# Altium schematic sheet Tay_Cam.SchDoc (part 2 of 3)
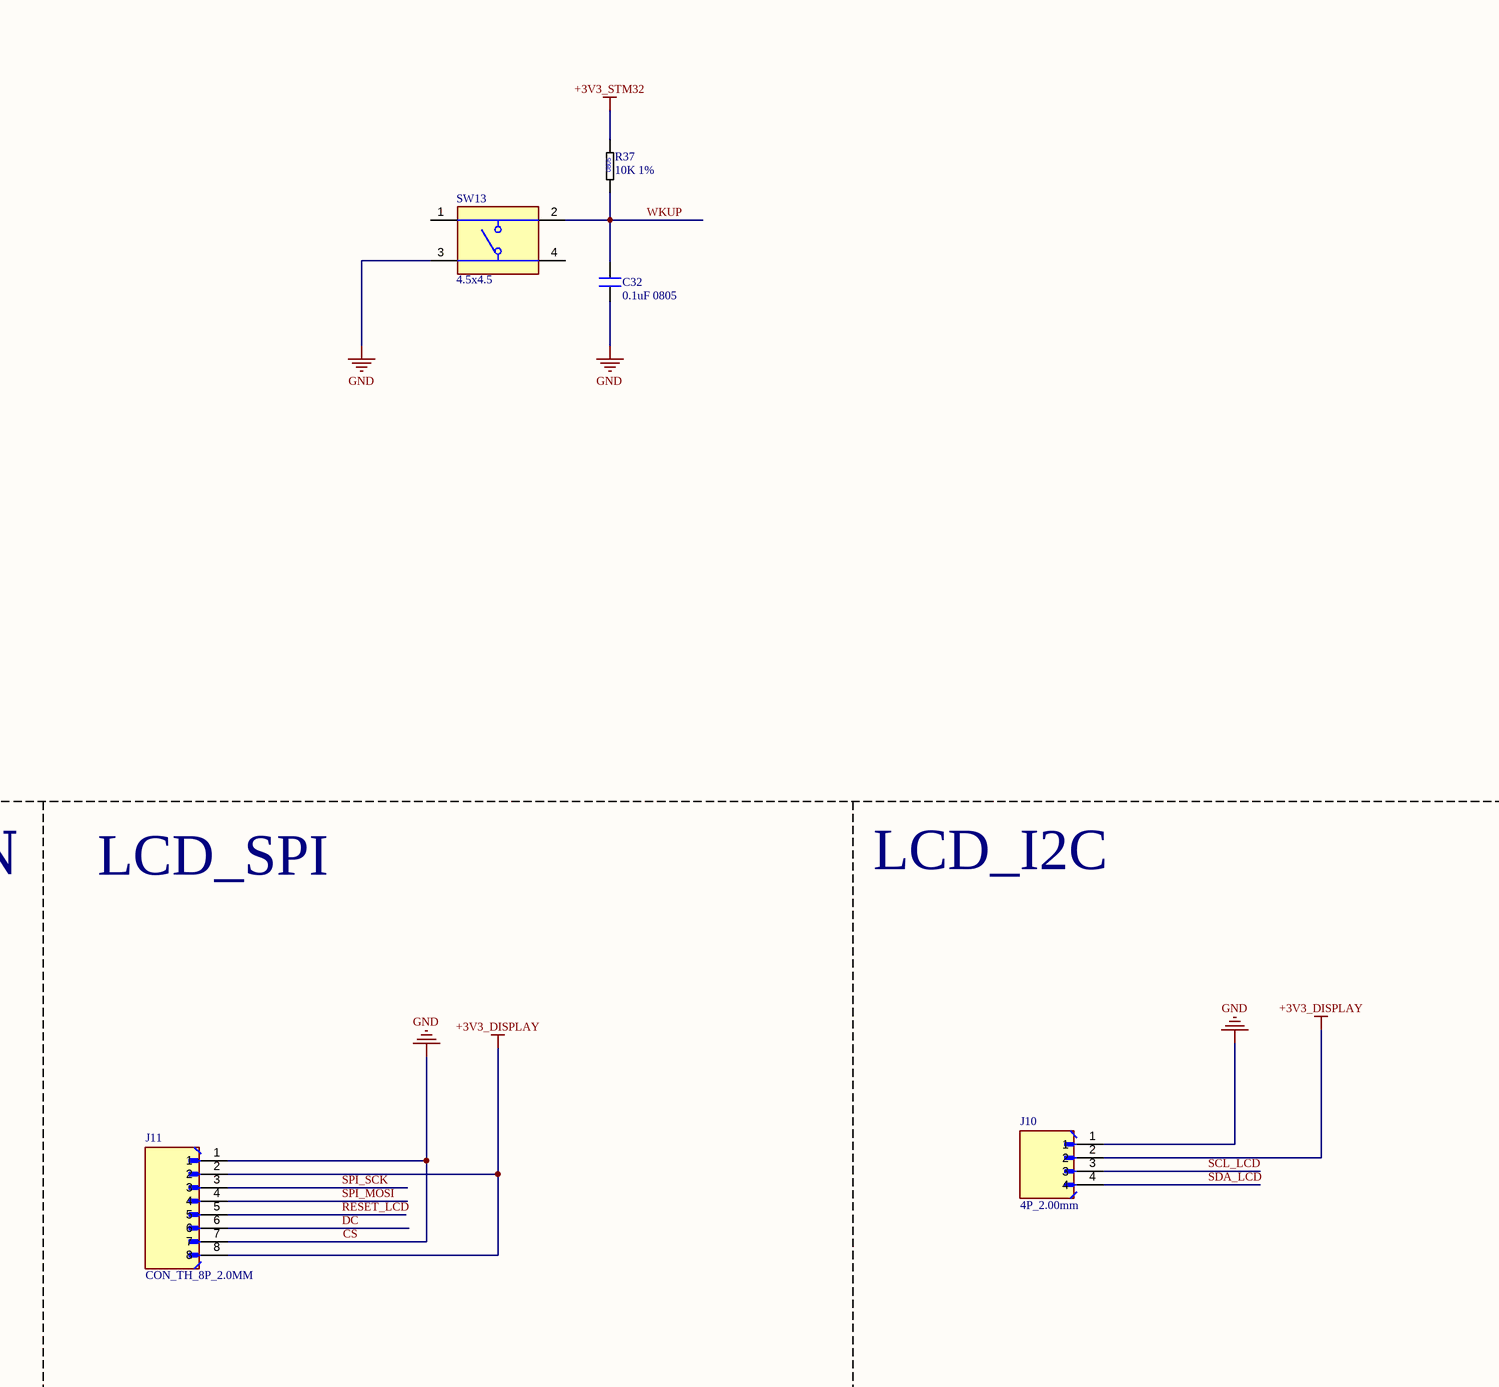
[diagram p8: Tay_Cam.SchDoc, bottom column 4 of 4]
## Library data of the parts
1 = CONN_SIM HOLDER 9P: 8 (6 + 2) Position Card Connector SIM Card Surface Mount, Right Angle Gold; Manufacturer: Molex; Manufacturer Part Number: 0475532001; LIBRARY MADE BY: MR. XUAN SIEU; Supplier 1: Digikey; RoHS: No; Category: Connectors; Stock 1: 21245; Pricing 1: 1=1.23, 10=1.043, 25=0.9776, 50=0.931, 100=0.8865, 250=0.83092, 500=0.79124 (USD); ComponentLink1URL: https://datasheet.octopart.com/SIM8066-6-1-14-01-A-Global-Connector-Technology-datasheet-155811920.pdf?src-supplier=Future+Electronics; ComponentLink1Description: https://datasheet.octopart.com/SIM8066-6-1-14-01-A-Global-Connector-Technology-datasheet-155811920.pdf?src-supplier=Future+Electronics; LINK VIET NAM: https://linhkien.cxtvn.com/2380-sim-card-holders-47553-2001.html; LINK ORIGINAL: https://www.digikey.com/en/products/detail/molex/0475532001/3262276?s=N4IgTCBcDaICwHYCsSDMBaMAGLBGEAugL5A; Link: https://muahang.nhaphangchina.vn/order/product/1688/45557949549
AT1 = Antenna_IPEX: Antenna
BUT1 = Nut Nhan 2 Chan SMD 3x6x2.5: Ma_Hang: MH001036; Ten: Nút Nhấn 2 Chân 3x6x2.5MM SMD
C1 C4 C9 C27 = CAP_CER_SMD; 1000PF 50V X7R 0805 10%: 1000 pF (102,1nF) ±10% 50V Ceramic Capacitor X7R 0805 (2012 Metric),; Manufacturer Cross: KEMET; Manufacturer Part Number: C0805C102K5RACTU; Dielectric Material: 4241ConductorMaterial; Temperature Coefficient: 30ppm/°C; LIBRARY MADE BY: MR. XUAN SIEU; Supplier 1: Digikey; RoHS: Yes; Category: Ceramic Capacitors; Stock 1: 269175; Pricing 1: 1=0.11, 10=0.061, 50=0.042, 100=0.0362, 500=0.02634, 1000=0.02329, 4000=0.01874, 8000=0.01701, 12000=0.01614, 20000=0.01517, 28000=0.0146, 40000=0.01406, 100000=0.01287, 200000=0.01215, 400000=0.01155 (USD); Mount: Surface Mount,PCB; Case/Package: 0805; Number of Pins: 2; Case Code (Imperial): 0805; Case Code (Metric): 2012; Material: 4241ConductorMaterial; Min Operating Temperature: -55°C; Max Operating Temperature: 125°C; Tolerance: 10%; Packaging: Tape and Reel; Capacitance: 1nF; Dielectric: X7R; Voltage: 50V; Series: SMD Comm X7R; Voltage Rating: 50V; Package Quantity: 4000; Termination: SMD/SMT; Construction: Flat; Voltage Rating (DC): 50V; Length: 2mm; Width: 1.25mm; Height: 0.78mm; Depth: 1.25mm; Lead Pitch: 0.75mm; Thickness: 889um; Radiation Hardening: No; Reach SVHC Compliant: No; RoHS Compliant: Yes; Lead Free: 5697LeadFree; ComponentLink1URL: https://www.distrelec.biz/Web/Downloads/_t/ds/KEM_C1002_X7R_SMD_eng_tds.pdf?mime=application%2Fpdf&src-supplier=Distrelec; ComponentLink1Description: https://www.distrelec.biz/Web/Downloads/_t/ds/KEM_C1002_X7R_SMD_eng_tds.pdf?mime=application%2Fpdf&src-supplier=Distrelec; ComponentLink2URL: http://www.farnell.com/datasheets/2740679.pdf?src-supplier=Farnell; ComponentLink2Description: http://www.farnell.com/datasheets/2740679.pdf?src-supplier=Farnell; ComponentLink3URL: http://www.onlinecomponents.com/productFiles/mf-KEM/kem_c1002_x7r_smd.pdf?src-supplier=Onlinecomponents.com; ComponentLink3Description: http://www.onlinecomponents.com/productFiles/mf-KEM/kem_c1002_x7r_smd.pdf?src-supplier=Onlinecomponents.com; ComponentLink4URL: http://www.farnell.com/datasheets/2740679.pdf?src-supplier=Element14; ComponentLink4Description: http://www.farnell.com/datasheets/2740679.pdf?src-supplier=Element14; ComponentLink5URL: https://datasheet.octopart.com/C0805C102K5RACTU-Kemet-datasheet-24570007.pdf?src-supplier=Element14; ComponentLink5Description: https://datasheet.octopart.com/C0805C102K5RACTU-Kemet-datasheet-24570007.pdf?src-supplier=Element14; ComponentLink6URL: https://api.kemet.com/component-edge/download/datasheet/C0805C102K5RACTU.pdf?src-supplier=Digikey; ComponentLink6Description: https://api.kemet.com/component-edge/download/datasheet/C0805C102K5RACTU.pdf?src-supplier=Digikey; ComponentLink7URL: http://www.farnell.com/datasheets/2740679.pdf?src-supplier=Newark; ComponentLink7Description: http://www.farnell.com/datasheets/2740679.pdf?src-supplier=Newark; ComponentLink8URL: https://www.alliedelec.com/m/d/9bfe7773041ffe9d406e68bc7b377fdd.pdf?src-supplier=Allied+Electronics; ComponentLink8Description: https://www.alliedelec.com/m/d/9bfe7773041ffe9d406e68bc7b377fdd.pdf?src-supplier=Allied+Electronics; Supplier Part Number 1: 399-C0805C102K5RACTUCT-ND; ComponentLink9Description: Link Viet Nam; ComponentLink9URL: https://linhkien.cxtvn.com/3023-tu-khong-phan-cuc-0805.html; ComponentLink10Description: Link Cross; ComponentLink10URL: https://www.lcsc.com/product-detail/Multilayer-Ceramic-Capacitors-MLCC-SMD-SMT_KEMET-C0805C102K5RACTU_C2167366.html?s_z=n_C0805C102K5RACTU; ComponentLink11Description: Link Original; ComponentLink11URL: https://www.digikey.com/en/products/detail/kemet/C0805C102K5RACTU/411146
C2 = CAP_CER_SMD; 10PF 50V C0G/NP0 0805 2.5%: Cap Ceramic 10pF 50V C0G 0.25pF Pad SMD 0805 125°C T/R; Manufacturer: Samsung Electro-Mechanics; Manufacturer Part Number: CL21C100CBANNNC; Temperature Coefficient: 30ppm/°C; Tolerance: 5%; LIBRARY MADE BY: MR. XUAN SIEU; Supplier 1: DigiKey; RoHS: Compliant; Category: Ceramic Capacitors; Stock 1: 78846; Pricing 1: 1=0.1, 10=0.044, 50=0.0302, 100=0.026, 500=0.0169, 1000=0.01376 (USD); Capacitance: 10pF; Case/Package: 0805; Case Code (Imperial): 0805; Case Code (Metric): 2012; China RoHS: Compliant; Depth: 1.25mm; Dielectric: C0G; Dielectric Material: Ceramic; Height: 650µm; Length: 2mm; Lifecycle Status: Production; Material: Ceramic; Max Operating Temperature: 125°C; Min Operating Temperature: -55°C; Mount: Surface Mount; Number of Terminals: 2; Radiation Hardening: No; REACH SVHC: Yes; Schedule B: 8532240020, 8532240020|8532240020, 8532240020|8532240020|8532240020, 8532240020|8532240020|8532240020|8532240020; Thickness: 762µm; Voltage: 50V; Voltage Rating: 50V; Voltage Rating (DC): 50V; Width: 1.25mm; ComponentLink1URL: https://datasheet.octopart.com:443/CL21C100CBANNNC-Samsung-Electro-Mechanics-datasheet-136551476.pdf?src-supplier=IHS; ComponentLink1Description: https://datasheet.octopart.com:443/CL21C100CBANNNC-Samsung-Electro-Mechanics-datasheet-136551476.pdf?src-supplier=IHS; ComponentLink2URL: https://datasheet.octopart.com:443/CL21C100CBANNNC-Samsung-Electro-Mechanics-datasheet-149066775.pdf?src-supplier=Future+Electronics; ComponentLink2Description: https://datasheet.octopart.com:443/CL21C100CBANNNC-Samsung-Electro-Mechanics-datasheet-149066775.pdf?src-supplier=Future+Electronics; ComponentLink3URL: https://datasheet.octopart.com:443/CL21C100CBANNNC-Samsung-Electro-Mechanics-datasheet-110334009.pdf?src-supplier=Future+Electronics; ComponentLink3Description: https://datasheet.octopart.com:443/CL21C100CBANNNC-Samsung-Electro-Mechanics-datasheet-110334009.pdf?src-supplier=Future+Electronics; ComponentLink4URL: https://datasheet.octopart.com:443/CL21C100CBANNNC-Samsung-Electro-Mechanics-datasheet-101746655.pdf?src-supplier=Future+Electronics; ComponentLink4Description: https://datasheet.octopart.com:443/CL21C100CBANNNC-Samsung-Electro-Mechanics-datasheet-101746655.pdf?src-supplier=Future+Electronics; ComponentLink5URL: https://datasheet.octopart.com/CL21C100CBANNNC-Samsung-Electro-Mechanics-datasheet-97040617.pdf; ComponentLink5Description: https://datasheet.octopart.com/CL21C100CBANNNC-Samsung-Electro-Mechanics-datasheet-97040617.pdf; ComponentLink6URL: https://datasheet.octopart.com/CL21C100CBANNNC-Samsung-Electro-Mechanics-datasheet-8324245.pdf; ComponentLink6Description: https://datasheet.octopart.com/CL21C100CBANNNC-Samsung-Electro-Mechanics-datasheet-8324245.pdf; ComponentLink7URL: https://datasheet.octopart.com/General-Multilayer-Ceramic-Capacitors-Samsung-datasheet-family-111.pdf; ComponentLink7Description: https://datasheet.octopart.com/General-Multilayer-Ceramic-Capacitors-Samsung-datasheet-family-111.pdf; ComponentLink8URL: https://datasheet.octopart.com:443/CL21C100CBANNNC-Samsung-datasheet-8326407.pdf?src-supplier=TME; ComponentLink8Description: https://datasheet.octopart.com:443/CL21C100CBANNNC-Samsung-datasheet-8326407.pdf?src-supplier=TME; ComponentLink9URL: http://sigma.octopart.com:80/rohs_certificate/General-Multilayer-Ceramic-Capacitors-Samsung-family-110.pdf?src-supplier=Compliance+Statements; ComponentLink9Description: http://sigma.octopart.com:80/rohs_certificate/General-Multilayer-Ceramic-Capacitors-Samsung-family-110.pdf?src-supplier=Compliance+Statements; ComponentLink10URL: http://sigma.octopart.com:80/rohs_statement/General-Multilayer-Ceramic-Capacitors-Samsung-family-132.pdf?src-supplier=Compliance+Statements; ComponentLink10Description: http://sigma.octopart.com:80/rohs_statement/General-Multilayer-Ceramic-Capacitors-Samsung-family-132.pdf?src-supplier=Compliance+Statements; ComponentLink11URL: http://sigma.octopart.com:80/reach_statement/General-Multilayer-Ceramic-Capacitors-Samsung-family-133.pdf?src-supplier=Compliance+Statements; ComponentLink11Description: http://sigma.octopart.com:80/reach_statement/General-Multilayer-Ceramic-Capacitors-Samsung-family-133.pdf?src-supplier=Compliance+Statements; Supplier Part Number 1: 1276-2561-1-ND; LINK VIET NAM: https://linhkien.cxtvn.com/4872-tu-khong-phan-cuc-0805.html; LINK ORIGINAL: https://www.digikey.com/en/products/detail/samsung-electro-mechanics/CL21C100CBANNNC/3888219
C3 = CAP_CER_SMD; 33PF 50V C0G/NP0 0805 10%: Cap Ceramic 33pF (330) 50V C0G 10% SMD 0805 125C Paper T/R; Manufacturer Cross: KEMET; Manufacturer Part Number: C0805C330K5GACTU; Material: 4241ConductorMaterial; Dissipation Factor: 0.1%; Temperature Coefficient: 30ppm/°C; LIBRARY MADE BY: MR. XUAN SIEU; Supplier 1: Digikey; RoHS: Yes; Category: Ceramic Capacitors; Stock 1: 67884; Pricing 1: 1=0.1, 10=0.09, 100=0.0688, 1000=0.0514 (USD); Mount: Surface Mount; Case/Package: 0805; Case Code (Metric): 2012; Case Code (Imperial): 0805; Dielectric Material: 4241ConductorMaterial; Min Operating Temperature: -55°C; Max Operating Temperature: 125°C; Capacitance: 33pF; Package Quantity: 4000; Voltage Rating: 50V; Voltage Rating (DC): 50V; Tolerance: 10%; Packaging: Tape and Reel; Dielectric: C0G; Termination: SMD/SMT; Series: C; Construction: Flat; Length: 2mm; Width: 0.049inch; Height: 0.78mm; Thickness: 0.035inch; Lead Pitch: 0.75mm; Depth: 1.25mm; Radiation Hardening: No; Reach SVHC Compliant: No; RoHS Compliant: Yes; Lead Free: 5697LeadFree; ComponentLink1URL: https://datasheet.ciiva.com/26948/getdatasheetpartid-780465-26948481.pdf?src-supplier=Verical; ComponentLink1Description: https://datasheet.ciiva.com/26948/getdatasheetpartid-780465-26948481.pdf?src-supplier=Verical; ComponentLink2Description: Link Original; ComponentLink2URL: https://www.digikey.com/en/products/detail/kemet/C0805C330K5GACTU/2212525; ComponentLink3Description: Link Cross; ComponentLink3URL: https://www.lcsc.com/product-detail/Multilayer-Ceramic-Capacitors-MLCC-SMD-SMT_KEMET-C0805C330K5GACTU_C2169038.html?s_z=n_C0805C330K5GACTU; ComponentLink4Description: Link Viet Nam; ComponentLink4URL: https://linhkien.cxtvn.com/3499-tu-330-33pf-0805-50v-10c.html; Supplier Part Number 1: 399-C0805C330K5GACTUCT-ND
C5 C14 C25 C29 = CAP_CER_SMD; 0.1UF 50V X7R 0805 10%: 0.1 (104) µF ±10% 50V Ceramic Capacitor X7R 0805 (2012 Metric); Manufacturer Cross: Yageo; Manufacturer Part Number: CC0805KRX7R9BB104; Capacitance: 100nF; Insulation Resistance: 100GR; LIBRARY MADE BY: MR. XUAN SIEU; Supplier 1: Digikey; RoHS: Yes; Category: Ceramic Capacitors; Stock 1: 3664790; Pricing 1: 1=0.08, 10=0.032, 100=0.026, 1000=0.02, 4000=0.0176, 8000=0.01595, 12000=0.01512, 20000=0.0142, 28000=0.01367, 40000=0.01315, 100000=0.01202, 200000=0.01134, 400000=0.01077 (USD); Mount: Surface Mount; Case/Package: 0805; Number of Pins: 2; Case Code (Metric): 2012; Case Code (Imperial): 0805; Material: Ceramic; Min Operating Temperature: -55°C; Max Operating Temperature: 125°C; Packaging: Tape and Reel; Tolerance: 10%; Voltage Rating: 50V; Package Quantity: 4000; Dielectric: X7R; Termination: SMD/SMT; Voltage: 50V; Series: CC; Length: 2mm; Height: 0.85mm; Depth: 1.25mm; Radiation Hardening: No; Reach SVHC Compliant: No; RoHS Compliant: Yes; Lead Free: 5697LeadFree; Halogen Free: 5694HalogenFree; ComponentLink1URL: https://datasheet.ciiva.com/46393/1734573-46393307.pdf?src-supplier=Element14; ComponentLink1Description: https://datasheet.ciiva.com/46393/1734573-46393307.pdf?src-supplier=Element14; ComponentLink2URL: https://datasheet.ciiva.com/155/mlccorderingcode-155930.pdf?src-supplier=Digikey; ComponentLink2Description: https://datasheet.ciiva.com/155/mlccorderingcode-155930.pdf?src-supplier=Digikey; ComponentLink3URL: https://datasheet.ciiva.com/29242/445210-da-01-en-kerko-chip-0805-x7r-0-1uf-10proz-50vg-29242074.pdf?src-supplier=Conrad; ComponentLink3Description: https://datasheet.ciiva.com/29242/445210-da-01-en-kerko-chip-0805-x7r-0-1uf-10proz-50vg-29242074.pdf?src-supplier=Conrad; ComponentLink4Description: Link Cross; ComponentLink4URL: https://www.lcsc.com/product-detail/Multilayer-Ceramic-Capacitors-MLCC-SMD-SMT_YAGEO-CC0805KRX7R9BB104_C49678.html?s_z=n_CC0805KRX7R9BB104; ComponentLink5Description: Link Viet Nam; ComponentLink5URL: https://linhkien.cxtvn.com/1976-tu-khong-phan-cuc-0805.html; ComponentLink6Description: Link Original; ComponentLink6URL: https://www.digikey.com/en/products/detail/yageo/CC0805KRX7R9BB104/302874; Supplier Part Number 1: 311-1140-1-ND
C6 = CAP_CER_SMD; 1UF 50V X7R 0805 10%: Cap Ceramic 1uF 50V X7R 10% SMD 0805 125°C Embossed Plastic T/R; Manufacturer Cross: Samsung; Manufacturer Part Number: CL21B105KBFNNNG; LIBRARY MADE BY: MR. XUAN SIEU; Supplier 1: Digikey; RoHS: Yes; Category: Ceramic Capacitors; Stock 1: 238551; Pricing 1: 1=0.11, 10=0.06, 100=0.0358, 1000=0.02348 (USD); Mount: Surface Mount; Case/Package: 0805; Case Code (Metric): 2012; Case Code (Imperial): 0805; Material: Ceramic; Min Operating Temperature: -55°C; Max Operating Temperature: 125°C; Tolerance: 10%; Packaging: Tape and Reel; Capacitance: 1uF; Voltage Rating: 50V; Series: CL; Dielectric: X7R; Voltage Rating (DC): 50V; Package Quantity: 3000; Voltage: 50V; Length: 0.079inch; Width: 0.049inch; Thickness: 0.053inch; Depth: 1.25mm; RoHS Compliant: Yes; ComponentLink1URL: https://datasheet.ciiva.com/25733/cl21b105kbfnnng-25733278.pdf?src-supplier=Digikey; ComponentLink1Description: https://datasheet.ciiva.com/25733/cl21b105kbfnnng-25733278.pdf?src-supplier=Digikey; ComponentLink2URL: https://datasheet.ciiva.com/29199/455898-da-01-en-vs-kondensator-0805-29199201.pdf?src-supplier=Conrad; ComponentLink2Description: https://datasheet.ciiva.com/29199/455898-da-01-en-vs-kondensator-0805-29199201.pdf?src-supplier=Conrad; ComponentLink3URL: https://datasheet.ciiva.com/26310/mlcc-catalogdownload2013-eng-26310125.pdf?src-supplier=Distrelec; ComponentLink3Description: https://datasheet.ciiva.com/26310/mlcc-catalogdownload2013-eng-26310125.pdf?src-supplier=Distrelec; ComponentLink4URL: https://datasheet.ciiva.com/16428/cl05b104kq5nnnc-16428872.pdf?src-supplier=Future+Electronics; ComponentLink4Description: https://datasheet.ciiva.com/16428/cl05b104kq5nnnc-16428872.pdf?src-supplier=Future+Electronics; ComponentLink5Description: Link Original; ComponentLink5URL: https://www.digikey.com/en/products/detail/samsung-electro-mechanics/CL21B105KBFNNNG/3894467?s=N4IgTCBcDaIMIBkwEYBCyAMBWA0qgYgHLEDiIAugL5A; ComponentLink6Description: Link Cross; ComponentLink6URL: https://www.lcsc.com/product-detail/Multilayer-Ceramic-Capacitors-MLCC-SMD-SMT_Samsung-Electro-Mechanics-CL21B105KBFNNNE_C28323.html?s_z=n_CL21B105KBFNNNG; ComponentLink7Description: Link Viet Nam; ComponentLink7URL: https://linhkien.cxtvn.com/6335-c0805c105k5pac7800-cap-cer-1uf-50v-10-x5r-0805.html; Supplier Part Number 1: 1276-6470-1-ND
C7 C11 C16 C21 = C-SM: X7R 100nF 50V ±10% 0603 Multilayer Ceramic Capacitors MLCC - SMD/SMT ROHS; Manufacturer: YAGEO; User: 1; Package: 0603; Link QT: *; Link VN: *
C8 = CAP_CER_SMD; 470PF 50V C0G/NP0 0805 5%: 470 pF ±5% 50V Ceramic Capacitor C0G, NP0 0805 (2012 Metric); Manufacturer: Wurth Elektronik; Manufacturer Part Number: 885012007061; Insulation Resistance: 10GΩ; Supplier 1: DigiKey; RoHS: Compliant; Category: Ceramic Capacitors; Stock 1: 9826; Pricing 1: 1=0.15, 10=0.086, 50=0.0604, 100=0.0526, 500=0.03956, 1000=0.03554 (USD); Capacitance: 470pF; Case/Package: 0805; Case Code (Imperial): 0805; Case Code (Metric): 2012; Height: 800µm; Length: 2mm; Max Operating Temperature: 125°C; Min Operating Temperature: -55°C; Mount: Surface Mount; Packaging: Cut Tape; Thickness: 889µm; Tolerance: 5%; Voltage Rating: 50V; Voltage Rating (DC): 50V; Width: 1.25mm; ComponentLink1URL: https://datasheet.octopart.com:443/885012007061-Wurth-Elektronik-datasheet-159617428.pdf?src-supplier=Wurth+Elektronik; ComponentLink1Description: https://datasheet.octopart.com:443/885012007061-Wurth-Elektronik-datasheet-159617428.pdf?src-supplier=Wurth+Elektronik; ComponentLink2URL: https://datasheet.octopart.com:443/885012007061-W%C3%BCrth-Elektronik-datasheet-82513931.pdf?src-supplier=Wurth+Elektronik; ComponentLink2Description: https://datasheet.octopart.com:443/885012007061-W%C3%BCrth-Elektronik-datasheet-82513931.pdf?src-supplier=Wurth+Elektronik; Supplier Part Number 1: 732-7856-1-ND
C10 C20 = C-ELEC-ALU-SM: Aluminum Electrolytic Capacitors - Surface Mount
C12 C22 = C-SM_1: X7R 100nF 50V ±10% 0603 Multilayer Ceramic Capacitors MLCC - SMD/SMT ROHS; Manufacturer: YAGEO; User: 1; Package: 0603; Link QT: *; Link VN: *
C13 C24 C28 = CAP_CER_SMD; 10UF 25V X5R 0805 10%: 10 µF ±10% 25V Ceramic Capacitor X5R 0805 (2012 Metric); Manufacturer Cross: Murata; Manufacturer Part Number: GRM21BR61E106KA73L; LIBRARY MADE BY: MR. XUAN SIEU; Supplier 1: Digikey; RoHS: Yes; Category: Ceramic Capacitors; Stock 1: 1799838; Pricing 1: 1=0.2, 10=0.086, 50=0.0696, 100=0.0528, 500=0.0484, 1000=0.044 (USD); Mount: Surface Mount; Case/Package: 0805; Case Code (Metric): 2012; Case Code (Imperial): 0805; Material: Ceramic; Min Operating Temperature: -55°C; Max Operating Temperature: 85°C; Package Quantity: 1; Capacitance: 10uF; Voltage Rating: 25V; Tolerance: 10%; Packaging: Tape and Reel; Voltage Rating (DC): 25V; Dielectric: X5R; Termination: SMD/SMT; Voltage: 25V; Series: GRM; Construction: Flat; Length: 2mm; Width: 0.049inch; Height: 1.25mm; Thickness: 0.053inch; Depth: 1.25mm; Reach SVHC Compliant: No; RoHS Compliant: Yes; Lead Free: 5697LeadFree; ComponentLink1URL: https://datasheet.ciiva.com/22774/1747469-22774396.pdf?src-supplier=Farnell; ComponentLink1Description: https://datasheet.ciiva.com/22774/1747469-22774396.pdf?src-supplier=Farnell; ComponentLink2URL: https://datasheet.ciiva.com/28584/626718-28584288.pdf?src-supplier=Element14; ComponentLink2Description: https://datasheet.ciiva.com/28584/626718-28584288.pdf?src-supplier=Element14; ComponentLink3URL: https://datasheet.ciiva.com/5424/product-5424327.pdf?src-supplier=Mouser; ComponentLink3Description: https://datasheet.ciiva.com/5424/product-5424327.pdf?src-supplier=Mouser; ComponentLink4URL: https://datasheet.ciiva.com/29199/454623-da-01-en-vs-kondensator-0805-29199615.pdf?src-supplier=Conrad; ComponentLink4Description: https://datasheet.ciiva.com/29199/454623-da-01-en-vs-kondensator-0805-29199615.pdf?src-supplier=Conrad; ComponentLink5URL: https://datasheet.ciiva.com/14116/grmseries-highdielectrictype-eng-14116376.pdf?src-supplier=Distrelec; ComponentLink5Description: https://datasheet.ciiva.com/14116/grmseries-highdielectrictype-eng-14116376.pdf?src-supplier=Distrelec; ComponentLink6URL: https://datasheet.ciiva.com/7719/1747469-7719093.pdf?src-supplier=Element14; ComponentLink6Description: https://datasheet.ciiva.com/7719/1747469-7719093.pdf?src-supplier=Element14; ComponentLink7URL: https://datasheet.ciiva.com/28584/626718-28584279.pdf?src-supplier=Element14; ComponentLink7Description: https://datasheet.ciiva.com/28584/626718-28584279.pdf?src-supplier=Element14; ComponentLink8URL: https://datasheet.ciiva.com/139/partnumbering-e-01-139183.pdf?src-supplier=Digikey; ComponentLink8Description: https://datasheet.ciiva.com/139/partnumbering-e-01-139183.pdf?src-supplier=Digikey; ComponentLink9URL: https://datasheet.ciiva.com/139/partnumbering-e-01-139182.pdf?src-supplier=Digikey; ComponentLink9Description: https://datasheet.ciiva.com/139/partnumbering-e-01-139182.pdf?src-supplier=Digikey; ComponentLink10URL: https://datasheet.ciiva.com/139/partnumbering-e-01-139184.pdf?src-supplier=Digikey; ComponentLink10Description: https://datasheet.ciiva.com/139/partnumbering-e-01-139184.pdf?src-supplier=Digikey; Supplier Part Number 1: 490-5523-6-ND; ComponentLink11Description: Link Viet Nam; ComponentLink11URL: https://linhkien.cxt.vn/5861-tmk212bbj106mg-t-cap-cer-10uf-25v-x5r-0805.html; ComponentLink12Description: Link Original; ComponentLink12URL: https://www.digikey.com/en/products/detail/murata-electronics/GRM21BR61E106KA73L/2334874; ComponentLink13Description: Link Cross; ComponentLink13URL: https://www.lcsc.com/product-detail/Multilayer-Ceramic-Capacitors-MLCC-SMD-SMT_Murata-Electronics-GRM21BR61E106KA73L_C84416.html
C15 = CAPCER0094 0805 0.22uF/25V 220nF: CAP CER 0.22uF/25V 10% X7R 0805 SMD; LINE: SMT; UNIT: PCS; CERT: NA; CLASS: B; DESIGN MADE: Huy Cao Keu; MOUNT: SMD
C17-C19 C36 C39 = CAP_CER_SMD; 22PF 50V C0G/NP0 0805 5%: Capacitor; Ceramic; Cap; 22.0pF; Tol 5%; SMT; Vol-Rtg 50V; C0G; Tape and Reel | KEMET C0805C220J5GACTU; LIBRARY MADE BY: MR. XUAN SIEU; Supplier 1: Digikey; Manufacturer Cross: KEMET; Manufacturer Part Number: C0805C220J5GACTU; RoHS: Yes; Category: Ceramic Capacitors; Stock 1: 208649; Pricing 1: 1=0.1, 10=0.042, 100=0.0243, 1000=0.0194, 4000=0.01203, 8000=0.01082, 12000=0.01022, 20000=0.01004, 28000=0.00958, 40000=0.00932, 100000=0.00858, 200000=0.00772 (USD); Mount: Surface Mount,PCB; Case/Package: 0805; Case Code (Metric): 2012; Case Code (Imperial): 0805; Weight: 0.000194oz; Contact Material: Tin; Contact Plating: Tin,Matte; Material: Ceramic; Min Operating Temperature: -55°C; Max Operating Temperature: 125°C; Packaging: Tape and Reel; Capacitance: 22pF; Tolerance: 5%; Voltage Rating: 50V; Voltage Rating (DC): 50V; Dielectric: C0G; Termination: SMD/SMT; Voltage: 50V; Series: SMD Comm C0G; Construction: Flat; Length: 2mm; Width: 1.25mm; Height: 0.78mm; Depth: 1.25mm; Radiation Hardening: No; Reach SVHC Compliant: No; Lead Free: Lead Free; RoHS Compliant: Yes; ComponentLink1URL: https://datasheet.ciiva.com/7842/1732694-7842250.pdf?src-supplier=Element14; ComponentLink1Description: https://datasheet.ciiva.com/7842/1732694-7842250.pdf?src-supplier=Element14; ComponentLink2URL: https://datasheet.ciiva.com/7842/1372242-7842570.pdf?src-supplier=Element14; ComponentLink2Description: https://datasheet.ciiva.com/7842/1372242-7842570.pdf?src-supplier=Element14; ComponentLink3URL: https://datasheet.ciiva.com/7842/1732694-7842251.pdf?src-supplier=Element14; ComponentLink3Description: https://datasheet.ciiva.com/7842/1732694-7842251.pdf?src-supplier=Element14; ComponentLink4URL: https://datasheet.ciiva.com/7842/kem-c1003-c0g-smd-7842569.pdf?src-supplier=Element14; ComponentLink4Description: https://datasheet.ciiva.com/7842/kem-c1003-c0g-smd-7842569.pdf?src-supplier=Element14; ComponentLink5URL: https://datasheet.ciiva.com/28668/1789732-28668761.pdf?src-supplier=Element14; ComponentLink5Description: https://datasheet.ciiva.com/28668/1789732-28668761.pdf?src-supplier=Element14; ComponentLink6Description: Link Cross; ComponentLink6URL: https://www.lcsc.com/product-detail/Multilayer-Ceramic-Capacitors-MLCC-SMD-SMT_KEMET-C0805C220J2GACTU_C1620086.html?s_z=n_C0805C220J5GACTU; ComponentLink7Description: Link Viet Nam; ComponentLink7URL: https://linhkien.cxtvn.com/1061-tu-220-22pf-0805-50v-5-10c.html; ComponentLink8Description: Link Original; ComponentLink8URL: https://www.digikey.com/en/products/detail/kemet/C0805C220J5GACTU/411112; Supplier Part Number 1: 399-C0805C220J5GACTUCT-ND
C23 = CAP_CER_SMD; 100PF 50V C0G/NP0 0805 10%: 100 pF ±5% 50V Ceramic Capacitor C0G, NP0 0805 (2012 Metric); Manufacturer Cross: Samsung; Manufacturer Part Number: CL21C101JBANNNC; LIBRARY MADE BY: MR. XUAN SIEU; Supplier 1: Digikey; RoHS: Yes; Category: Ceramic Capacitors; Stock 1: 43699; Pricing 1: 1=0.1, 10=0.037, 100=0.0216, 1000=0.01368 (USD); Voltage Rating (DC): 50V; Lead Free: 5697LeadFree; RoHS Compliant: 5897YesNo; ComponentLink1URL: https://datasheet.ciiva.com/25710/cl21c101jbannnc-25710193.pdf?src-supplier=Digikey; ComponentLink1Description: https://datasheet.ciiva.com/25710/cl21c101jbannnc-25710193.pdf?src-supplier=Digikey; ComponentLink2URL: https://datasheet.ciiva.com/29199/454082-da-01-en-vs-kondensator-0805-29199900.pdf?src-supplier=Conrad; ComponentLink2Description: https://datasheet.ciiva.com/29199/454082-da-01-en-vs-kondensator-0805-29199900.pdf?src-supplier=Conrad; ComponentLink3Description: Link Original; ComponentLink3URL: https://www.digikey.com/en/products/detail/samsung-electro-mechanics/CL21C101JBANNNC/3886672; ComponentLink4Description: Link Cross; ComponentLink4URL: https://www.lcsc.com/product-detail/Multilayer-Ceramic-Capacitors-MLCC-SMD-SMT_Samsung-Electro-Mechanics-CL21C101JBANNNC_C1790.html?s_z=n_CL21C101JBANNNC; ComponentLink5Description: Link Viet Nam; ComponentLink5URL: https://linhkien.cxtvn.com/3499-tu-330-33pf-0805-50v-10c.html; Supplier Part Number 1: 1276-1014-1-ND
C26 = CAP_CER_SMD; 0.33UF 50V X7R 0805 10%: 0.33 µF ±10% 50V Ceramic Capacitor X7R 0805 (2012 Metric); Manufacturer: Wurth Electronics; Manufacturer Part Number: 885012207101; Capacitance: 330nF; LIBRARY MADE BY: MR. XUAN SIEU; Supplier 1: Digikey; RoHS: Yes; Category: Ceramic Capacitors; Stock 1: 79; Pricing 1: 1=0.17, 10=0.151, 100=0.136, 500=0.121 (USD); Mount: Surface Mount; Case/Package: 0805; Case Code (Metric): 2012; Case Code (Imperial): 0805; Min Operating Temperature: -55°C; Max Operating Temperature: 125°C; Packaging: Cut Tape; Voltage Rating: 50V; Tolerance: 10%; Series: WCAP-CSGP; Length: 0.079inch; Width: 0.049inch; Thickness: 0.053inch; RoHS Compliant: Yes; ComponentLink1URL: https://katalog.we-online.de/pbs/datasheet/885012207101.pdf?src-supplier=Digikey; ComponentLink1Description: https://katalog.we-online.de/pbs/datasheet/885012207101.pdf?src-supplier=Digikey; Supplier Part Number 1: 732-7676-1-ND; LINK VIET NAM: https://linhkienchatluong.vn/tu-dan-0805/tu-dan-0805-334-330nf-033uf-50v-10c_sp1293_ct14678.aspx; LINK ORIGINAL: https://www.digikey.com/en/products/detail/w%C3%BCrth-elektronik/885012207101/5453531
C30 C31 = CAP_CER_SMD; 22UF 25V X5R 0805 20%: 25V 22uF X5R ±20% 0805 Multilayer Ceramic Capacitors MLCC - SMD/SMT ROHS; Manufacturer: Samsung Electro-Mechanics; Manufacturer Part Number: CL21A226MAYNNNE; Capacitance: 22µF; Supplier 1: DigiKey; RoHS: Compliant; Category: Ceramic Capacitors; Stock 1: 818636; Pricing 1: 1=0.24, 10=0.14, 50=0.1004, 100=0.0885, 500=0.06838, 1000=0.06218 (USD); Case/Package: 0805; China RoHS: Compliant; Dielectric: X5R; Dielectric Material: Ceramic; Height: 1.25mm; Length: 2mm; Lifecycle Status: Production; Material: Ceramic; Max Operating Temperature: 85°C; Min Operating Temperature: -55°C; Mount: Surface Mount; Number of Terminals: 2; REACH SVHC: Yes; Schedule B: 8532240020; Tolerance: 20%; Voltage Rating: 25V; Voltage Rating (DC): 25V; Width: 1.25mm; ComponentLink1URL: https://datasheet.octopart.com:443/CL21A226MAYNNNE-Samsung-Electro-Mechanics-datasheet-137343010.pdf?src-supplier=IHS; ComponentLink1Description: https://datasheet.octopart.com:443/CL21A226MAYNNNE-Samsung-Electro-Mechanics-datasheet-137343010.pdf?src-supplier=IHS; ComponentLink2URL: https://datasheet.octopart.com:443/CL21A226MAYNNNE-Samsung-Electro-Mechanics-datasheet-137126787.pdf?src-supplier=Newark; ComponentLink2Description: https://datasheet.octopart.com:443/CL21A226MAYNNNE-Samsung-Electro-Mechanics-datasheet-137126787.pdf?src-supplier=Newark; ComponentLink3URL: https://datasheet.octopart.com/CL21A226MAYNNNE-Samsung-Electro-Mechanics-datasheet-97040617.pdf; ComponentLink3Description: https://datasheet.octopart.com/CL21A226MAYNNNE-Samsung-Electro-Mechanics-datasheet-97040617.pdf; ComponentLink4URL: https://datasheet.octopart.com/CL21A226MAYNNNE-Samsung-Electro-Mechanics-datasheet-8324245.pdf; ComponentLink4Description: https://datasheet.octopart.com/CL21A226MAYNNNE-Samsung-Electro-Mechanics-datasheet-8324245.pdf; ComponentLink5URL: https://datasheet.octopart.com/General-Multilayer-Ceramic-Capacitors-Samsung-datasheet-family-111.pdf; ComponentLink5Description: https://datasheet.octopart.com/General-Multilayer-Ceramic-Capacitors-Samsung-datasheet-family-111.pdf; ComponentLink6URL: https://datasheet.octopart.com:443/CL21A226MAYNNNE-Samsung-datasheet-8326407.pdf?src-supplier=TME; ComponentLink6Description: https://datasheet.octopart.com:443/CL21A226MAYNNNE-Samsung-datasheet-8326407.pdf?src-supplier=TME; ComponentLink7URL: https://datasheet.octopart.com:443/CL21A226MAYNNNE-Samsung-Electro-Mechanics-datasheet-149154243.pdf?src-supplier=Future+Electronics; ComponentLink7Description: https://datasheet.octopart.com:443/CL21A226MAYNNNE-Samsung-Electro-Mechanics-datasheet-149154243.pdf?src-supplier=Future+Electronics; ComponentLink8URL: http://sigma.octopart.com:80/rohs_certificate/General-Multilayer-Ceramic-Capacitors-Samsung-family-110.pdf?src-supplier=Compliance+Statements; ComponentLink8Description: http://sigma.octopart.com:80/rohs_certificate/General-Multilayer-Ceramic-Capacitors-Samsung-family-110.pdf?src-supplier=Compliance+Statements; ComponentLink9URL: http://sigma.octopart.com:80/rohs_statement/General-Multilayer-Ceramic-Capacitors-Samsung-family-132.pdf?src-supplier=Compliance+Statements; ComponentLink9Description: http://sigma.octopart.com:80/rohs_statement/General-Multilayer-Ceramic-Capacitors-Samsung-family-132.pdf?src-supplier=Compliance+Statements; ComponentLink10URL: http://sigma.octopart.com:80/reach_statement/General-Multilayer-Ceramic-Capacitors-Samsung-family-133.pdf?src-supplier=Compliance+Statements; ComponentLink10Description: http://sigma.octopart.com:80/reach_statement/General-Multilayer-Ceramic-Capacitors-Samsung-family-133.pdf?src-supplier=Compliance+Statements; Supplier Part Number 1: 1276-CL21A226MAYNNNECT-ND
C32-C35 C37 C40-C48 = CAP_CER,SMD;0.1uF,10%,0805,50V,X7R: 0.1 (104) µF ±10% 50V Ceramic Capacitor X7R 0805 (2012 Metric); Manufacturer Cross: Yageo; Manufacturer Part Number: CC0805KRX7R9BB104; Capacitance: 100nF; Insulation Resistance: 100GR; LIBRARY MADE BY: MR. XUAN SIEU; Supplier 1: Digikey; RoHS: Yes; Category: Ceramic Capacitors; Stock 1: 3664790; Pricing 1: 1=0.08, 10=0.032, 100=0.026, 1000=0.02, 4000=0.0176, 8000=0.01595, 12000=0.01512, 20000=0.0142, 28000=0.01367, 40000=0.01315, 100000=0.01202, 200000=0.01134, 400000=0.01077 (USD); Mount: Surface Mount; Case/Package: 0805; Number of Pins: 2; Case Code (Metric): 2012; Case Code (Imperial): 0805; Material: Ceramic; Min Operating Temperature: -55°C; Max Operating Temperature: 125°C; Packaging: Tape and Reel; Tolerance: 10%; Voltage Rating: 50V; Package Quantity: 4000; Dielectric: X7R; Termination: SMD/SMT; Voltage: 50V; Series: CC; Length: 2mm; Height: 0.85mm; Depth: 1.25mm; Radiation Hardening: No; Reach SVHC Compliant: No; RoHS Compliant: Yes; Lead Free: 5697LeadFree; Halogen Free: 5694HalogenFree; ComponentLink1URL: https://datasheet.ciiva.com/46393/1734573-46393307.pdf?src-supplier=Element14; ComponentLink1Description: https://datasheet.ciiva.com/46393/1734573-46393307.pdf?src-supplier=Element14; ComponentLink2URL: https://datasheet.ciiva.com/155/mlccorderingcode-155930.pdf?src-supplier=Digikey; ComponentLink2Description: https://datasheet.ciiva.com/155/mlccorderingcode-155930.pdf?src-supplier=Digikey; ComponentLink3URL: https://datasheet.ciiva.com/29242/445210-da-01-en-kerko-chip-0805-x7r-0-1uf-10proz-50vg-29242074.pdf?src-supplier=Conrad; ComponentLink3Description: https://datasheet.ciiva.com/29242/445210-da-01-en-kerko-chip-0805-x7r-0-1uf-10proz-50vg-29242074.pdf?src-supplier=Conrad; ComponentLink4Description: Link Cross; ComponentLink4URL: https://www.lcsc.com/product-detail/Multilayer-Ceramic-Capacitors-MLCC-SMD-SMT_YAGEO-CC0805KRX7R9BB104_C49678.html?s_z=n_CC0805KRX7R9BB104; ComponentLink5Description: Link Viet Nam; ComponentLink5URL: https://linhkien.cxtvn.com/1976-tu-khong-phan-cuc-0805.html; ComponentLink6Description: Link Original; ComponentLink6URL: https://www.digikey.com/en/products/detail/yageo/CC0805KRX7R9BB104/302874; Supplier Part Number 1: 311-1140-1-ND
D1 = DIODE,SMD;DF2S6,TVS,9V: 9V (Typ) Clamp 1A (8/20¦Ìs) Ipp Tvs Diode Surface Mount SOD-923; Manufacturer Cross: Toshiba; Manufacturer Part Number: DF2S6.8FS,L3M; Number of Unidirectional Channels: 1; Reverse Standoff Voltage: 5V; Min Breakdown Voltage: 6.4V; Power Line Protection: No; Diode Type: ZENER; LIBRARY MADE BY: MR. XUAN SIEU; Supplier 1: Digikey; RoHS: No; Category: TVS Diodes; Stock 1: 462569; Pricing 1: 1=0.1, 10=0.068, 100=0.025, 500=0.023, 1000=0.021, 2000=0.0205, 5000=0.02 (USD); Mount: Surface Mount; Packaging: Cut Tape; Peak Pulse Current: 1A; Series: -; RoHS Compliant: No; ComponentLink1URL: http://www.mouser.com/ds/2/408/DF2S6.8FS_datasheet_en_20140709-708755.pdf?src-supplier=Mouser; ComponentLink1Description: http://www.mouser.com/ds/2/408/DF2S6.8FS_datasheet_en_20140709-708755.pdf?src-supplier=Mouser; ComponentLink2URL: https://toshiba.semicon-storage.com/info/docget.jsp?did=22219&prodName=DF2S6.8FS&src-supplier=Digikey; ComponentLink2Description: https://toshiba.semicon-storage.com/info/docget.jsp?did=22219&prodName=DF2S6.8FS&src-supplier=Digikey; ComponentLink3Description: Link Original; ComponentLink3URL: https://www.digikey.com/en/products/detail/toshiba-semiconductor-and-storage/DF2S6-8FS-L3M/3191286?s=N4IgTCBcDaICIDEwGUBsA6AHA5IC6AvkA; ComponentLink4Description: Link Cross; ComponentLink4URL: https://www.lcsc.com/product-detail/ESD-and-Surge-Protection-TVS-ESD_TOSHIBA-DF2S6-8FS-L3M_C1972978.html?s_z=n_DF2S6.8FS%252CL3M; ComponentLink5Description: Link Viet Nam; ComponentLink5URL: N/A; Supplier Part Number 1: DF2S6.8FS(TL4D)CT-ND
D2 D5 = 1N5822(SS34)-SM: 3.0A Schottky Barrier Rectifiers - Surface Mount
D3 D4 = LED_SMD;0805,AMBER: WL-SMCW Mono-color Chip LED Waterclear, SMT, size 0805, Amber, 2V, 140°; Manufacturer Part Number: 150080AS75000; Manufacturer: Wurth Elektronik; Case/Size Code: 0805; Chip Technology: AlInGaP; Dominant Wavelength: 605nm; Luminous Intensity: 130mcd; Peak Wavelength: 610nm; LIBRARY MADE BY: MR. XUAN SIEU; Category: Signal LEDs; Match Code: WL-SMCW; ComponentLink1Description: Website Link; ComponentLink1URL: https://www.we-online.com/redexpert/article/150080AS75000?ad; ComponentLink2Description: Datasheet Link; ComponentLink2URL: https://www.we-online.com/redexpert/spec/150080AS75000?ad; Mount: Surface Mount; Operating Temperature Max: 85°C; Operating Temperature Min: -40°C; Packaging: Tape and Reel; Length: 2mm; Width: 1.25mm; Height: 0.7mm; Emitting Color: Amber; Forward Voltage: 2V; Viewing Angle: 140°; Link Viet Nam: https://linhkien.cxtvn.com/6190-led-0805-cac-mau.html
D6 = DIODE,SMD;DF2S6,TVS,9V_1: 9V (Typ) Clamp 1A (8/20¦Ìs) Ipp Tvs Diode Surface Mount SOD-923; Manufacturer Cross: Toshiba; Manufacturer Part Number: DF2S6.8FS,L3M; Number of Unidirectional Channels: 1; Reverse Standoff Voltage: 5V; Min Breakdown Voltage: 6.4V; Power Line Protection: No; Diode Type: ZENER; LIBRARY MADE BY: MR. XUAN SIEU; Supplier 1: Digikey; RoHS: No; Category: TVS Diodes; Stock 1: 462569; Pricing 1: 1=0.1, 10=0.068, 100=0.025, 500=0.023, 1000=0.021, 2000=0.0205, 5000=0.02 (USD); Mount: Surface Mount; Packaging: Cut Tape; Peak Pulse Current: 1A; Series: -; RoHS Compliant: No; ComponentLink1URL: http://www.mouser.com/ds/2/408/DF2S6.8FS_datasheet_en_20140709-708755.pdf?src-supplier=Mouser; ComponentLink1Description: http://www.mouser.com/ds/2/408/DF2S6.8FS_datasheet_en_20140709-708755.pdf?src-supplier=Mouser; ComponentLink2URL: https://toshiba.semicon-storage.com/info/docget.jsp?did=22219&prodName=DF2S6.8FS&src-supplier=Digikey; ComponentLink2Description: https://toshiba.semicon-storage.com/info/docget.jsp?did=22219&prodName=DF2S6.8FS&src-supplier=Digikey; ComponentLink3Description: Link Original; ComponentLink3URL: https://www.digikey.com/en/products/detail/toshiba-semiconductor-and-storage/DF2S6-8FS-L3M/3191286?s=N4IgTCBcDaICIDEwGUBsA6AHA5IC6AvkA; ComponentLink4Description: Link Cross; ComponentLink4URL: https://www.lcsc.com/product-detail/ESD-and-Surge-Protection-TVS-ESD_TOSHIBA-DF2S6-8FS-L3M_C1972978.html?s_z=n_DF2S6.8FS%252CL3M; ComponentLink5Description: Link Viet Nam; ComponentLink5URL: N/A; Supplier Part Number 1: DF2S6.8FS(TL4D)CT-ND
D7 D8 = LED_SMD;0805,RED: WL-SMCW Mono-color Chip LED Waterclear, SMT, size 0805, Red, 2V, 140°; Manufacturer Part Number: 150080RS75000; Manufacturer: Wurth Elektronik; Case/Size Code: 0805; Chip Technology: AlInGaP; Dominant Wavelength: 625nm; Luminous Intensity: 150mcd; Peak Wavelength: 630nm; LIBRARY MADE BY: MR. XUAN SIEU; Category: Signal LEDs; Match Code: WL-SMCW; ComponentLink1Description: Website Link; ComponentLink1URL: https://www.we-online.com/redexpert/article/150080RS75000?ad; ComponentLink2Description: Datasheet Link; ComponentLink2URL: https://www.we-online.com/redexpert/spec/150080RS75000?ad; Mount: Surface Mount; Operating Temperature Max: 85°C; Operating Temperature Min: -40°C; Packaging: Tape and Reel; Length: 2mm; Width: 1.25mm; Height: 0.7mm; Emitting Color: Red; Forward Voltage: 2V; Viewing Angle: 140°; Link Viet Nam: https://linhkien.cxtvn.com/6190-led-0805-cac-mau.html
D9 = DIODE_SMD;DIODE ZENER 3.6V: ZMM3V6 Diode Zener 0.5W 3.6V SOD-80; Manufacture 1: Microchip Tech; Manufacture Part Number 1: 1N4148UR-1; LIBRARY MADE BY: MR. XUAN SIEU; Power: 200mA; Voltage: 75V; Name: DIODE-SWITCHING_1N4148UR-1; Temperature: -65℃~+175℃@(Tj); Link: https://www.lcsc.com/product-detail/Switching-Diode_Microchip-Tech-1N4148UR-1_C3312663.html; LINK ORIGINAL: https://www.digikey.com/en/products/detail/microchip-technology/1n4148ur-1/4377991; LINK VIET NAM: https://linhkien.cxtvn.com/2399-diode-1n4148-ll4148-sod-801206-smd-10c.html; Package: DO-213AA
DEBUG1 = JUMP_FEMALE;4P,2.54MM: Female, 4 C, Straight, .100"CC; 3.20mm Tail, No Mounting; PBT, Phos. Bronze, 105 C; Manufacturer: Sullins; Manufacturer Part Number: PPPC041LFBN-RC; Supplier 1: Digikey; RoHS: Yes; Category: Connectors; Stock 1: 28559; Pricing 1: 1=0.42, 10=0.353, 100=0.2996, 500=0.26738, 1000=0.2546, 5000=0.22726, 10000=0.21641 (USD); Contact Material: 150ConductorMaterial; Housing Material: 4239ConductorMaterial; Length: 10.7mm; Width: 2.5mm; Height: 8.5mm; Lead Free: 5697LeadFree; ComponentLink1URL: https://media.digikey.com/pdf/Data%20Sheets/Sullins%20PDFs/Female_Headers.100_DS.pdf?src-supplier=Digikey; ComponentLink1Description: https://media.digikey.com/pdf/Data%20Sheets/Sullins%20PDFs/Female_Headers.100_DS.pdf?src-supplier=Digikey; ComponentLink2URL: http://www.sullinscorp.com/catalogs/78_Page80-81_HEADER_.100_2.54mm_FEMALE.pdf?src-supplier=Future+Electronics; ComponentLink2Description: http://www.sullinscorp.com/catalogs/78_Page80-81_HEADER_.100_2.54mm_FEMALE.pdf?src-supplier=Future+Electronics; ComponentLink3URL: https://datasheet.octopart.com/PPPC041LFBN-RC-Sullins-datasheet-41308905.pdf?src-supplier=Future+Electronics; ComponentLink3Description: https://datasheet.octopart.com/PPPC041LFBN-RC-Sullins-datasheet-41308905.pdf?src-supplier=Future+Electronics; Supplier Part Number 1: S7037-ND
EC1 EC2 = CAP_ALU_SMD; 100UF 20% 16V 6.3x5.5MM: 100 µF 16 V Aluminum Electrolytic Capacitors Radial, Can - SMD 2000 Hrs @ 105°C; Manufacturer: Wurth Electronics; Manufacturer Part Number: 865060343005; Insulation Resistance: 1MR; Ripple Current: 255mA; ESR (Equivalent Series Resistance): 393.664mR; Leakage Current: 16uA; LIBRARY MADE BY: MR. XUAN SIEU; Supplier 1: Digikey; RoHS: No; Category: Aluminum Electrolytic Capacitors; Stock 1: 6119; Pricing 1: 1=0.3, 50=0.255, 100=0.222, 250=0.197, 500=0.173 (USD); Voltage Rating (DC): 16V; Length: 5.5mm; ComponentLink1URL: http://www.farnell.com/datasheets/1880038.pdf?src-supplier=Farnell; ComponentLink1Description: http://www.farnell.com/datasheets/1880038.pdf?src-supplier=Farnell; ComponentLink2URL: https://katalog.we-online.de/pbs/datasheet/865060343005.pdf?src-supplier=Digikey; ComponentLink2Description: https://katalog.we-online.de/pbs/datasheet/865060343005.pdf?src-supplier=Digikey; ComponentLink3URL: http://www.farnell.com/datasheets/1880038.pdf?src-supplier=Newark; ComponentLink3Description: http://www.farnell.com/datasheets/1880038.pdf?src-supplier=Newark; ComponentLink4URL: http://www.farnell.com/datasheets/1880038.pdf?src-supplier=Element14; ComponentLink4Description: http://www.farnell.com/datasheets/1880038.pdf?src-supplier=Element14; LINK ORIGINAL: https://www.digikey.com/en/products/detail/w%C3%BCrth-elektronik/865060343005/5728117; LINK VIET NAM: https://linhkien.cxtvn.com/2034-tu-nhom-100uf-16v-63x54mm.html; Supplier Part Number 1: 732-8522-6-ND
IC1 = IC_SMD; IC REG LDO; SOT23-6; -40to85°C; AP62300TWU-7: DC-DC Switching Synchronous Buck Regulator, Adjustable, 4.2V-18Vin, 0.8V-7V/3A out, TSOT-26-6; Manufacturer: Diodes; Output Configuration: Positive; Number of Outputs: 1; Min Input Voltage: 4.2V; Max Input Voltage: 18V; Min Output Voltage: 800mV; Max Output Voltage: 7V; Output Current: 3A; Switching Frequency: 750kHz; Synchronous Rectifier: Yes; LIBRARY MADE BY: MR. XUAN SIEU; Supplier 1: Digikey; Manufacturer Part Number: AP62300TWU-7; RoHS: Yes; Category: Voltage Regulators - Switching; Stock 1: 56258; Pricing 1: 1=0.3, 10=0.21, 25=0.186, 100=0.16, 250=0.14752, 500=0.14004, 1000=0.13386 (USD); Mount: Surface Mount; Case/Package: SOT-23-6; Min Operating Temperature: -40°C; Max Operating Temperature: 85°C; Output Type: Adjustable; Series: -; ComponentLink1URL: https://datasheet.octopart.com/AP62300TWU-7-Diodes-Inc.-datasheet-149521341.pdf?src-supplier=Newark; ComponentLink1Description: https://datasheet.octopart.com/AP62300TWU-7-Diodes-Inc.-datasheet-149521341.pdf?src-supplier=Newark; ComponentLink2URL: https://www.diodes.com/assets/Datasheets/AP62300_AP62301_AP62300T.pdf?src-supplier=Digikey; ComponentLink2Description: https://www.diodes.com/assets/Datasheets/AP62300_AP62301_AP62300T.pdf?src-supplier=Digikey; LINK VIET NAM: N/A; LINK ORIGINAL: https://www.digikey.com/en/products/detail/diodes-incorporated/AP62300TWU-7/12702558; Supplier Part Number 1: 31-AP62300TWU-7CT-ND
J1 J2 J4 J6 J7 = 3P_2.00mm: Connector Header Through Hole 2 position 0.079 (2.00mm); MF: JST Sales America Inc.; MP: B3B-PH-K-S(LF)(SN); SnapEDA_Link: https://www.snapeda.com/parts/B3B-PH-K-S(LF)(SN)/JST+Sales+America+Inc./view-part/?ref=snap; Package: None; Value: *; Check_prices: https://www.snapeda.com/parts/B3B-PH-K-S(LF)(SN)/JST+Sales+America+Inc./view-part/?ref=eda
J3 J5 J8 J10 J12 = 4P_2.00mm: Connector Header Through Hole 4 position 0.079 (2.00mm); MF: JST Sales; MP: B4B-PH-K-S (LF)(SN); SnapEDA_Link: https://www.snapeda.com/parts/B4B-PH-K-S%20(LF)(SN)/JST/view-part/?ref=snap; Package: None; Value: *; Check_prices: https://www.snapeda.com/parts/B4B-PH-K-S%20(LF)(SN)/JST/view-part/?ref=eda
J9 = CONN_SMD,TYPE-C,6P: USB Type C - Connector, Top-mount, SMT, 6pos | Molex Incorporated 217175-0001; USB Standard: USB 2.0; Current Rating: 1.25A; Gender: Receptacle; Number of Contacts: 24; Voltage Rating: 30V; LIBRARY MADE BY: MR. XUAN SIEU; Supplier 1: Digikey; Manufacturer Cross: Molex; Manufacturer Part Number: 217175-0001; RoHS: No; Category: Connectors; Stock 1: 18256; Pricing 1: 1=0.75, 10=0.613, 25=0.5652, 50=0.5314, 100=0.4996, 250=0.46056, 500=0.4331 (USD); Contact Material: Nickel,Gold; Min Operating Temperature: -40°C; Max Operating Temperature: 85°C; Height: 3.46mm; ComponentLink1Description: Link Original; ComponentLink1URL: https://www.digikey.com/en/products/detail/molex/2171750001/13913745; ComponentLink2Description: Link Cross; ComponentLink2URL: https://www.lcsc.com/product-detail/USB-Connectors_MOLEX-2171750001_C3197922.html?s_z=n_2171750001; ComponentLink3Description: Link Viet Nam; ComponentLink3URL: https://linhkien.cxtvn.com/3892-cong-type-c-cai-6p-4-chan-co-dinh-usb-31-v2.html; Supplier Part Number 1: 900-2171750001CT-ND
J11 = CON_TH_8P_2.0MM: 2.0 mm pitch/Disconnectable Crimp style connectors; MF: JST; MP: B8B-PH-K-S; SnapEDA_Link: https://www.snapeda.com/parts/B8B-PH-K-S/JST/view-part/?ref=snap; Package: None; Value: *; Check_prices: https://www.snapeda.com/parts/B8B-PH-K-S/JST/view-part/?ref=eda
L1 = Ferrite Bead: Code_IEC: 1005; Value: 1K; Published: 8-Jun-2000; LatestRevisionDate: 29-May-2009; LatestRevisionNote: IPC-7351 Footprint Added.; Publisher: Altium Limited; PackageDescription: Chip Inductor; Code_JEITA: 0402
L2 L3 = L-WIRE-SM: Wirewound Inductor - Surface Mount
L4 = IND_SMD; FIXED IND 3.3UH 3.4A 28 MOHM 6x6x2.8MM: Inductor Power Shielded/Molded Wirewound 3.3uH 20% 100KHz Ferrite 3.4A 0.028Ohm DCR 2424 T/R; Manufacturer: Abracon; Manufacturer Part Number: ASPI-0628-3R3M-T1; DC Resistance (DCR): 28mΩ; Inductance: 3.3µH; Number of Circuits: 1; Saturation Current: 3.6A; Shielding: Yes; LIBRARY MADE BY: MR. XUAN SIEU; Supplier 1: DigiKey; RoHS: Compliant; Category: Fixed Inductors; Stock 1: 889; Pricing 1: 1=0.33, 10=0.275, 100=0.226 (USD); Case/Package: 2424; China RoHS: Compliant; Composition: Wirewound; Core Material: Ferrite; Current Rating: 3.4A; Height: 2.8mm; Height - Seated (Max): 2.794mm; Length: 6mm; Lifecycle Status: Production; Max Current Rating: 3.4A; Max Operating Temperature: 120°C; Min Operating Temperature: -25°C; Mount: Surface Mount; Number of Terminals: 2; REACH SVHC: Yes; Resistance: 28mΩ; Test Frequency: 100kHz; Tolerance: 20%; Width: 6mm; ComponentLink1URL: https://datasheet.octopart.com:443/ASPI-0628-3R3M-T1-Abracon-datasheet-182213420.pdf?src-supplier=Master+Electronics; ComponentLink1Description: https://datasheet.octopart.com:443/ASPI-0628-3R3M-T1-Abracon-datasheet-182213420.pdf?src-supplier=Master+Electronics; ComponentLink2URL: https://datasheet.octopart.com:443/ASPI-0628-3R3M-T1-Abracon-datasheet-141160310.pdf?src-supplier=JRH+Electronics; ComponentLink2Description: https://datasheet.octopart.com:443/ASPI-0628-3R3M-T1-Abracon-datasheet-141160310.pdf?src-supplier=JRH+Electronics; ComponentLink3URL: https://datasheet.octopart.com:443/ASPI-0628-3R3M-T1-Abracon-datasheet-101745434.pdf?src-supplier=Sager+Electronics; ComponentLink3Description: https://datasheet.octopart.com:443/ASPI-0628-3R3M-T1-Abracon-datasheet-101745434.pdf?src-supplier=Sager+Electronics; ComponentLink4URL: https://sigma.octopart.com:443/141160311/technical_drawing/Abracon-ASPI-0628-3R3M-T1.pdf?src-supplier=Abracon+SCT; ComponentLink4Description: https://sigma.octopart.com:443/141160311/technical_drawing/Abracon-ASPI-0628-3R3M-T1.pdf?src-supplier=Abracon+SCT; ComponentLink5URL: http://sigma.octopart.com:80/conflict_mineral_statement/Abracon-company-27.pdf?src-supplier=Compliance+Statements; ComponentLink5Description: http://sigma.octopart.com:80/conflict_mineral_statement/Abracon-company-27.pdf?src-supplier=Compliance+Statements; Supplier Part Number 1: 535-12808-6-ND; LINK VIET NAM: https://linhkien.cxtvn.com/9145-cuon-cam-5d28-cac-gia-tri.html; LINK ORIGINAL: https://www.digikey.com/en/products/detail/abracon-llc/ASPI-0628-3R3M-T1/5043505
LS1 = BUZZ_9X5.5MM: 9 mm, 3 V, 85 dB, Through Hole, Magnetic Audio Transducer Buzzer; MF: Same Sky; MP: CST-931AP; SnapEDA_Link: https://www.snapeda.com/parts/CST-931AP/Same+Sky/view-part/?ref=snap; Package: None; Value: *; Check_prices: https://www.snapeda.com/parts/CST-931AP/Same+Sky/view-part/?ref=eda
M1 = MODULE_SMD; MODULE SIM 4G, A7680C_CHIP: Cellular module; LTE Cat1 bis; GNSS (option); MP: SIM868; MF: MikroElektronika; LIBRARY MADE BY: MR. XUAN SIEU; Check_prices: https://www.snapeda.com/parts/SIM868/MikroElektronika/view-part/?ref=eda; Value: *; Availability: Not in stock; Price: None; Package: None; SnapEDA_Link: https://www.snapeda.com/parts/SIM868/MikroElektronika/view-part/?ref=snap; LINK VIET NAM: https://www.lazada.vn/products/bo-dieu-khien-simcom-a7680c-cat1-kich-thuoc-nho-tuong-thich-voi-sim800c-toan-cau-4g-lte-ho-tro-giao-thuc-tcpip-co-the-goi-dien-thoai-i2831789045.html?srsltid=AfmBOoosQrxJde6jj3jMc_vCVE_fzO6UQJ8IH7P6YqoQoCxdnF-xPq5n; LINK ORIGINAL: https://cn.simcom.com/product/A7680C.html
PWR_DISPLAY1 PWR_STM1 = LED-CHIP-SM: Chip LED - Surface Mount
Q1 Q2 Q5 Q6 = TRANS-BJT_SMD; NPN, 25V, 1.5A, SOT-23, SS8050-G: Trans Gp Bjt NPN 25V 1.5A 300MW 3-PIN SOT-23 T/r; Manufacturer Cross: Comchip; Transition Frequency: 100MHz; Collector-emitter Voltage-Max: 400mV; Collector Base Voltage (VCBO): 40V; Collector Emitter Saturation Voltage: 500mV; Emitter Base Voltage (VEBO): 5V; hFE Min: 200; Number of Elements: 1; LIBRARY MADE BY: MR. XUAN SIEU; Supplier 1: Digikey; Manufacturer Part Number: SS8050-G; RoHS: Yes; Category: Transistors; Stock 1: 130674; Pricing 1: 1=0.24, 10=0.148, 100=0.0921, 500=0.06754, 1000=0.05958 (USD); Mount: Surface Mount; Case/Package: TO-236-3; Max Operating Temperature: 150°C; Packaging: Cut Tape; Max Collector Current: 1.5A; Max Power Dissipation: 300mW; Collector Emitter Breakdown Voltage: 25V; Max Breakdown Voltage: 25V; Series: -; Power Dissipation: 300mW; Height: 1.15mm; RoHS Compliant: Yes; ComponentLink1URL: http://www.comchiptech.com/admin/files/product/SS8050-G RevA181526.pdf?src-supplier=Digikey; ComponentLink1Description: http://www.comchiptech.com/admin/files/product/SS8050-G RevA181526.pdf?src-supplier=Digikey; ComponentLink2Description: Link Viet Nam; ComponentLink2URL: https://linhkien.cxtvn.com/6446-mmss8050-l-tp-transistor-npn-25v-15a-sot-23.html; ComponentLink3Description: Link Original; ComponentLink3URL: https://www.digikey.com/en/products/detail/comchip-technology/SS8050-G/6138901; ComponentLink4Description: Link Cross; ComponentLink4URL: https://www.lcsc.com/product-detail/Bipolar-BJT_Comchip-SS8050-G_C3199946.html?s_z=n_SS8050-G; Supplier Part Number 1: 641-1790-1-ND